# Altium schematic sheet main_board.SchDoc
size A4
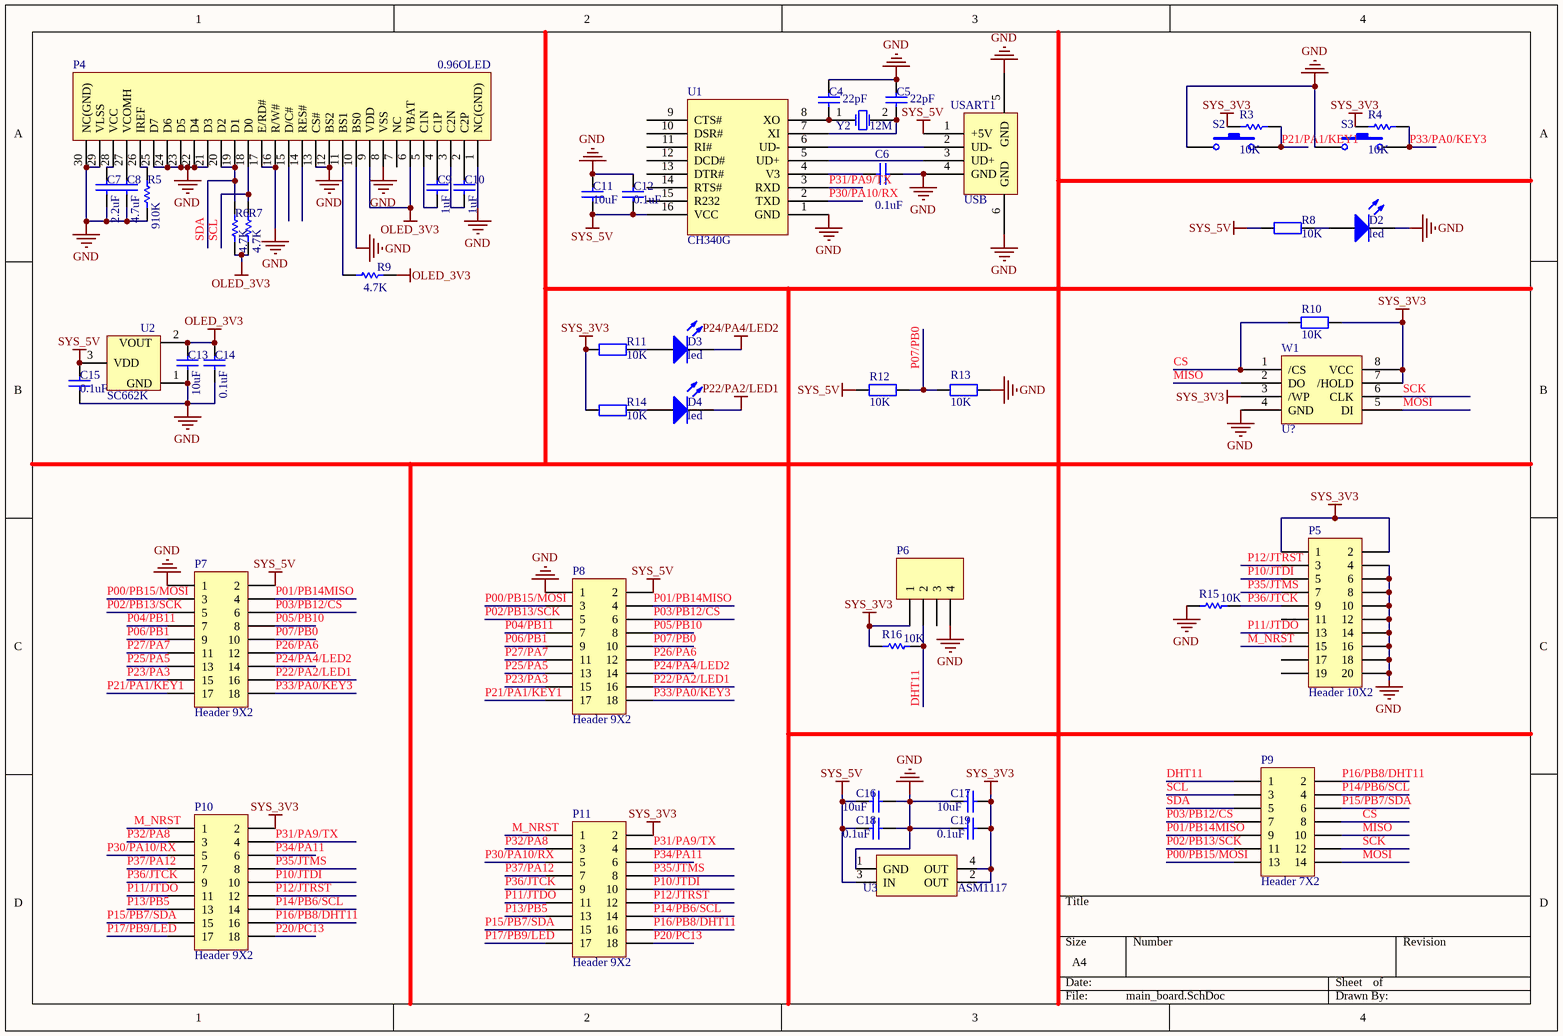
[diagram p0: main_board.SchDoc]

## Parts
C4  value 22pF  [6-0805_N]
C5  value 22pF  [6-0805_N]
C6  value 0.1uF  [6-0805_N]
C7  value 2.2uF  [6-0805_N]
C8  value 4.7uF  [6-0805_N]
C9  value 1uF  [6-0805_N]
C10  value 1uF  [6-0805_N]
C11  value 10uF  [6-0805_N]
C12  value 0.1uF  [6-0805_N]
C13  value 10uF  [6-0805_N]
C14  value 0.1uF  [6-0805_N]
C15  value 0.1uF  [6-0805_N]
C16  value 10uF  [6-0805_N]
C17  value 10uF  [6-0805_N]
C18  value 0.1uF  [6-0805_N]
C19  value 0.1uF  [6-0805_N]
D2  led  [LED]
D3  led  [LED]
D4  led  [LED]
P4  0.96OLED  [OLED]
P5  Header 10X2  [JLINK]
P6  (no value)  [DHT11]
P7  Header 9X2  [XDR2x9_S]
P8  Header 9X2  [XDR2x9_L_1]
P9  Header 7X2  [XDR2X7]
P10  Header 9X2  [XDR2x9_S]
P11  Header 9X2  [XDR2x9_L_2]
R3  value 10K  [6-0805_N]
R4  value 10K  [6-0805_N]
R5  value 910K  [6-0805_N]
R6  value 4.7K  [6-0805_N]
R7  value 4.7K  [6-0805_N]
R8  value 10K  [6-0805_N]
R9  value 4.7K  [6-0805_N]
R10  value 10K  [6-0805_N]
R11  value 10K  [6-0805_N]
R12  value 10K  [6-0805_N]
R13  value 10K  [6-0805_N]
R14  value 10K  [6-0805_N]
R15  value 10K  [6-0805_N]
R16  value 10K  [6-0805_N]
S2  (no value)  [SPST-2]
S3  (no value)  [SPST-2]
U1  CH340G  [SOP-16]
U2  SC662K  [SOP23]
U3  ASM1117  [SOT-223]
USART1  USB  [USB]
W1  U?  [SO8_N]
Y2  12M  [HC-49S]

## Nets
GND: C4.1 C5.1 C6.1 C7.1 C8.1 C11.1 C12.1 C13.1 C14.1 C15.1 C16.2 C17.1 C18.2 C19.1 D2.2(K) P4.1(NC(GND)) P4.8(VSS) P4.10(BS0) P4.12(BS2) P4.13(CS#) P4.16(R/W#) P4.17(E/RD#) P4.21(D3) P4.22(D4) P4.23(D5) P4.24(D6) P4.25(D7) P4.29(VLSS) P4.30(NC(GND)) P5.4 P5.6 P5.8 P5.10 P5.12 P5.14 P5.16 P5.18 P5.20 P6.4 P7.1 P8.1 R5.2 R13.2 R15.1 S2.1 S3.1 U1.1(GND) U2.1(GND) U3.1(GND) USART1.4(GND) USART1.5(GND) USART1.6(GND) W1.4(GND)
OLED_3V3: C13.2 C14.2 P4.6(VBAT) P4.9(VDD) R6.2 R7.2 R9.2 U2.2(VOUT)
P22/PA2/LED1: D4.2(K) P7.16 P8.16
P24/PA4/LED2: D3.2(K) P7.14 P8.14
SYS_3V3: C17.2 C19.2 P5.1 P5.2 P6.1 P10.2 P11.2 R3.2 R4.2 R10.1 R11.1 R14.1 R16.1 U3.2(OUT) U3.4(OUT) W1.3(/WP) W1.7(/HOLD) W1.8(VCC)
SYS_5V: C11.2 C12.2 C15.2 C16.1 C18.1 P7.2 P8.2 R8.1 R12.2 U1.16(VCC) U2.3(VDD) U3.3(IN) USART1.1(+5V)
CS: P9.8 R10.2 W1.1(/CS)
DHT11: P6.2 P9.1 R16.2
M_NRST: P5.15 P10.1 P11.1
MISO: P9.10 W1.2(DO)
MOSI: P9.14 W1.5(DI)
P00/PB15/MOSI: P7.3 P8.3 P9.13
P01/PB14MISO: P7.4 P8.4 P9.9
P02/PB13/SCK: P7.5 P8.5 P9.11
P03/PB12/CS: P7.6 P8.6 P9.7
P04/PB11: P7.7 P8.7
P05/PB10: P7.8 P8.8
P06/PB1: P7.9 P8.9
P07/PB0: P7.10 P8.10 R12.1 R13.1
P10/JTDI: P5.5 P10.10 P11.10
P11/JTDO: P5.13 P10.11 P11.11
P12/JTRST: P5.3 P10.12 P11.12
P13/PB5: P10.13 P11.13
P14/PB6/SCL: P9.4 P10.14 P11.14
P15/PB7/SDA: P9.6 P10.15 P11.15
P16/PB8/DHT11: P9.2 P10.16 P11.16
P17/PB9/LED: P10.17 P11.17
P20/PC13: P10.18 P11.18
P21/PA1/KEY1: P7.17 P8.17 R3.1 S2.2
P23/PA3: P7.15 P8.15
P25/PA5: P7.13 P8.13
P26/PA6: P7.12 P8.12
P27/PA7: P7.11 P8.11
P30/PA10/RX: P10.5 P11.5 U1.2(TXD)
P31/PA9/TX: P10.4 P11.4 U1.3(RXD)
P32/PA8: P10.3 P11.3
P33/PA0/KEY3: P7.18 P8.18 R4.1 S3.2
P34/PA11: P10.6 P11.6
P35/JTMS: P5.7 P10.8 P11.8
P36/JTCK: P5.9 P10.9 P11.9 R15.2
P37/PA12: P10.7 P11.7
SCK: P9.12 W1.6(CLK)
SCL: P4.18(D0) P9.3 R7.1
SDA: P4.19(D1) P4.20(D2) P9.5 R6.1
NetC4_2: C4.2 U1.8(XO) Y2.1(OSC1)
NetC5_2: C5.2 U1.7(XI) Y2.2(OSC2)
NetC6_2: C6.2 U1.4(V3)
NetC7_2: C7.2 P4.28(VCC)
NetC8_2: C8.2 P4.27(VCOMH)
NetC9_1: C9.1 P4.5(C1N)
NetC9_2: C9.2 P4.4(C1P)
NetC10_1: C10.1 P4.3(C2N)
NetC10_2: C10.2 P4.2(C2P)
NetD2_1: D2.1(A) R8.2
NetD3_1: D3.1(A) R11.2
NetD4_1: D4.1(A) R14.2
NetP4_11: P4.11(BS1) R9.1
NetP4_26: P4.26(IREF) R5.1
NetU1_5: U1.5(UD+) USART1.3(UD+)
NetU1_6: U1.6(UD-) USART1.2(UD-)

Not connected (* = marked no-connect by the designer): P4 7(NC) 14(RES#) 15(D/C#); P5 11 17 19; P6 3; U1 9(CTS#) 10(DSR#) 11(RI#) 12(DCD#) 13(DTR#) 14(RTS#) 15(R232)

## Library data of the parts
C4-C19 = Cap: Capacitor; Published: 8-Jun-2000; LatestRevisionDate: 17-Jul-2002; LatestRevisionNote: Re-released for DXP Platform.; PackageReference: RAD-0.3; Publisher: Altium Limited; PackageDescription: Radial Cap, Thru-Hole; 2 Leads; 0.3 in Pin Spacing
D2-D4 = LED0: Typical INFRARED GaAs LED; Published: 8-Jun-2000; LatestRevisionDate: 08-Jul-2005; LatestRevisionNote: Mech Layer 1 removed.; PackageReference: LED-0; Publisher: Altium Limited; PackageDescription: LED; 2 Leads
P4 = 0.96OLED: 接口; LatestRevisionDate: 17-Jul-2002; LatestRevisionNote: Re-released for DXP Platform.; Publisher: Altium Limited
P5 = Header 10X2: Header, 10-Pin, Dual row; LatestRevisionDate: 17-Jul-2002; LatestRevisionNote: Re-released for DXP Platform.; Publisher: Altium Limited
P6 = Header 4: Header, 4-Pin; LatestRevisionDate: 17-Jul-2002; LatestRevisionNote: Re-released for DXP Platform.; Publisher: Altium Limited
P7 P8 P10 P11 = Header 9X2: Header, 9-Pin, Dual row; LatestRevisionDate: 17-Jul-2002; LatestRevisionNote: Re-released for DXP Platform.; Publisher: Altium Limited
P9 = Header 7X2: Header, 7-Pin, Dual row; LatestRevisionDate: 17-Jul-2002; LatestRevisionNote: Re-released for DXP Platform.; Publisher: Altium Limited
R3-R7 R9 R15 R16 = Res1: Resistor; Published: 8-Jun-2000; LatestRevisionDate: 17-Jul-2002; LatestRevisionNote: Re-released for DXP Platform.; PackageReference: AXIAL-0.3; Publisher: Altium Limited; PackageDescription: Axial Device, Thru-Hole; 2 Leads; 0.3 in Pin Spacing
R8 R10-R14 = Res2: Resistor; Published: 8-Jun-2000; LatestRevisionDate: 17-Jul-2002; LatestRevisionNote: Re-released for DXP Platform.; PackageReference: AXIAL-0.4; Publisher: Altium Limited; PackageDescription: Axial Device, Thru-Hole; 2 Leads; 0.4 in Pin Spacing
S2 S3 = SW-PB: Switch; Published: 24-Mar-1999; LatestRevisionDate: 17-Jul-2002; LatestRevisionNote: Re-released for DXP Platform.; PackageReference: SPST-2; Publisher: Altium Limited; PackageDescription: Switch; 2 Leads
W1 = W25Q16
Y2 = XTAL: Crystal Oscillator; Published: 8-Jun-2000; LatestRevisionDate: 17-Jul-2002; LatestRevisionNote: Re-released for DXP Platform.; PackageReference: R38; Publisher: Altium Limited; PackageDescription: Crystal, Thru-Hole; 2 Leads; Body 3.1 x 8.2 mm (Dia.xH)